# Altium schematic sheet PICkit_2.SchDoc
size A3; SheetNumber: 1; SheetTotal: 1
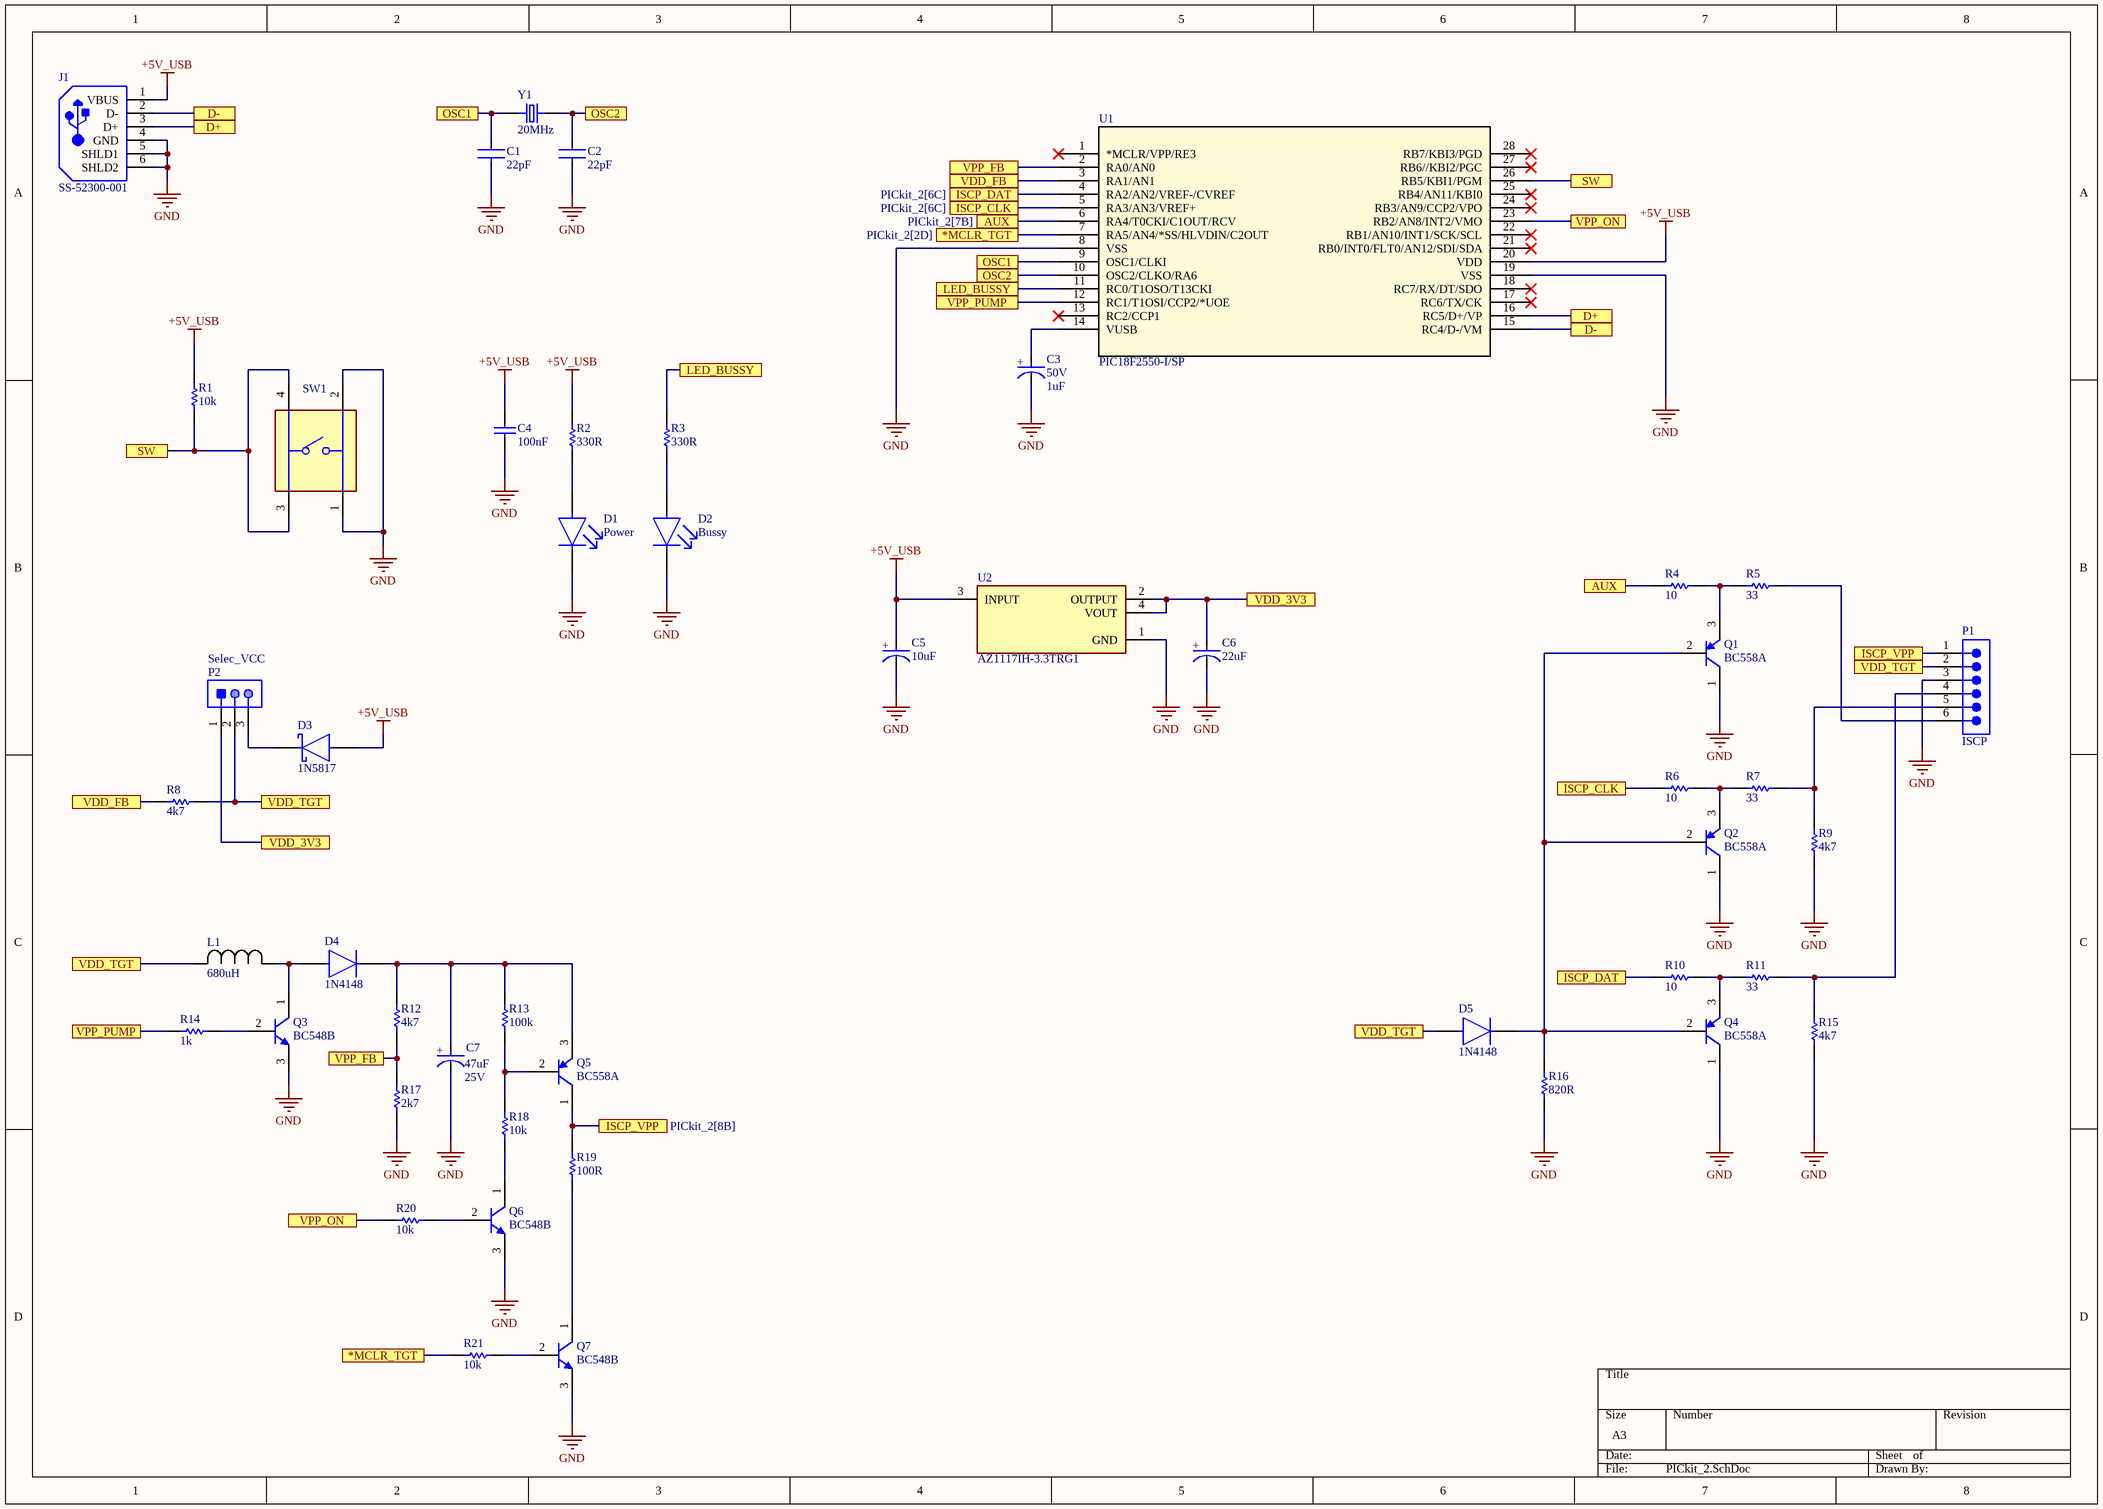
[diagram p0: PICkit_2.SchDoc]

## Parts
C1  Capacitance: 22pF  [FP-RCE0K1-MFG]  (hidden comment: RCE5C1H220J0K1H03B)
C2  Capacitance: 22pF  [FP-RCE0K1-MFG]  (hidden comment: RCE5C1H220J0K1H03B)
C3  Voltage: 50V  Capacitance: 1uF  [FP-RAD-TH-D_5_0_5-L_11_1-MFG]  (hidden comment: EEUHD1H1R0)
C4  Capacitance: 100nF  [CAPR51-254-508X318X736]  (hidden comment: C320C104K5R5TA)
C5  Capacitance: 10uF  [FP-RAD-TH-D_5_0_5-L_11_1-MFG]  (hidden comment: ECA1HHG100I)
C6  Capacitance: 22uF  [FP-RAD-TH-D_5_0_5-L_11_1-MFG]  (hidden comment: ECA1CM220B)
C7  Voltage Rating: 25V  Capacitance: 47uF  [FP-RAD-TH-D_5_0_5-L_11_1-MFG]  (hidden comment: EEUFM1E470)
D1  Colour: Power  [FP-HLMP-1719-MFG]  (hidden comment: HLMP-1719)
D2  Colour: Bussy  [FP-HLMP-1719-MFG]  (hidden comment: HLMP-1719)
D3  1N5817  [FP-DO-41-MFG]
D4  1N4148  [FP-6_560-5004_12-4-MFG]
D5  1N4148  [FP-6_560-5004_12-4-MFG]
J1  SS-52300-001  [SS-52300-001]
L1  Inductance: 680uH  [IND_BOURNS_78F]  (hidden comment: 78F681J-RC)
P1  ISCP  [SMTC-TSW-106-08-X-S-RA]
P2  Action: Selec_VCC  [MOLX-22-28-4033_V]  (hidden comment: 22-28-4033)
Q1  BC558A  [ONSC-TO-92-3-29-11_AM_BL]
Q2  BC558A  [ONSC-TO-92-3-29-11_AM_BL]
Q3  BC548B  [ONSC-TO-92-3-29-11]
Q4  BC558A  [ONSC-TO-92-3-29-11_AM_BL]
Q5  BC558A  [ONSC-TO-92-3-29-11_AM_BL]
Q6  BC548B  [ONSC-TO-92-3-29-11]
Q7  BC548B  [ONSC-TO-92-3-29-11]
R1  Resistance: 10k  [CF14JT10K0]  (hidden comment: CF14JT10K0)
R2  Resistance: 330R  [CF14JT10K0]  (hidden comment: 1-1623728-6)
R3  Resistance: 330R  [CF14JT10K0]  (hidden comment: 1-1623728-6)
R4  Resistance: 10  [RESA60-630X240]  (hidden comment: MFR-25FBF52-1K)
R5  Resistance: 33  [RESA60-630X240]  (hidden comment: MFR-25FBF52-1K)
R6  Resistance: 10  [RESA60-630X240]  (hidden comment: MFR-25FBF52-1K)
R7  Resistance: 33  [RESA60-630X240]  (hidden comment: MFR-25FBF52-1K)
R8  Resistance: 4k7  [CF14JT10K0]
R9  Resistance: 4k7  [CF14JT10K0]
R10  Resistance: 10  [RESA60-630X240]  (hidden comment: MFR-25FBF52-1K)
R11  Resistance: 33  [RESA60-630X240]  (hidden comment: MFR-25FBF52-1K)
R12  Resistance: 4k7  [CF14JT10K0]
R13  Resistance: 100k  [RESA60-630X240]  (hidden comment: MFR-25FBF52-1K)
R14  Resistance: 1k  [RESA60-630X240]  (hidden comment: MFR-25FBF52-1K)
R15  Resistance: 4k7  [CF14JT10K0]
R16  Resistance: 820R  [RESA60-630X240]  (hidden comment: MFR-25FBF52-1K)
R17  Resistance: 2k7  [RESA60-630X240]  (hidden comment: MFR-25FBF52-1K)
R18  Resistance: 10k  [RESA60-630X240]  (hidden comment: MFR-25FBF52-1K)
R19  Resistance: 100R  [RESA60-630X240]  (hidden comment: MFR-25FBF52-1K)
R20  Resistance: 10k  [RESA60-630X240]  (hidden comment: MFR-25FBF52-1K)
R21  Resistance: 10k  [RESA60-630X240]  (hidden comment: MFR-25FBF52-1K)
SW1  TS02-66-60-BK-100-LCR-D  [SW_TS02-66-60-BK-100-LCR-D]  (value not drawn)
U1  PIC18F2550-I/SP  [PIC18F2550-I/SP]
U2  AZ1117IH-3.3TRG1  [FP-SOT223-IPC_B]
Y1  Frequency: 20MHz  [XTAL_ECS-200-20-4X]  (hidden comment: ECS-200-20-4X)

## Ports
*MCLR_TGT (see PICkit_2[2D]), *MCLR_TGT (see PICkit_2[4A]), AUX (see PICkit_2[4A]), AUX (see PICkit_2[7B]), D+ (see PICkit_2[1A]), D+ (see PICkit_2[6A]), D- (see PICkit_2[1A]), D- (see PICkit_2[6A]), ISCP_CLK (see PICkit_2[4A]), ISCP_CLK (see PICkit_2[6C]), ISCP_DAT (see PICkit_2[4A]), ISCP_DAT (see PICkit_2[6C]), ISCP_VPP (see PICkit_2[3C]), ISCP_VPP (see PICkit_2[8B]), LED_BUSSY (see PICkit_2[3A]), LED_BUSSY (see PICkit_2[4A]), OSC1 (see PICkit_2[2A]), OSC1 (see PICkit_2[4A]), OSC2 (see PICkit_2[3A]), OSC2 (see PICkit_2[4A]), SW (see PICkit_2[1B]), SW (see PICkit_2[6A]), VDD_3V3 (see PICkit_2[1C]), VDD_3V3 (see PICkit_2[5B]), VDD_FB (see PICkit_2[1C]), VDD_FB (see PICkit_2[4A]), VDD_TGT (see PICkit_2[1C], PICkit_2[6C]), VDD_TGT (see PICkit_2[1C], PICkit_2[6C], PICkit_2[8B]), VDD_TGT (see PICkit_2[1C], PICkit_2[8B]), VPP_FB (see PICkit_2[2C]), VPP_FB (see PICkit_2[4A]), VPP_ON (see PICkit_2[2D]), VPP_ON (see PICkit_2[6A]), VPP_PUMP (see PICkit_2[1C]), VPP_PUMP (see PICkit_2[4A])

## Nets
+5V_USB: C4.1 C5.2(A) D3.2(A) J1.1(VBUS) R1.2 R2.1 U1.20(VDD) U2.3(INPUT)
GND: C1.1 C2.1 C3.1(C) C4.2 C5.1(C) C6.1(C) C7.1(C) D1.1(C) D2.1(C) J1.4(GND) J1.5(SHLD1) J1.6(SHLD2) P1.3 Q1.1(C) Q2.1(C) Q3.3(E) Q4.1(C) Q6.3(E) Q7.3(E) R9.2 R15.2 R16.1 R17.1 SW1.1 SW1.2 U1.8(VSS) U1.19(VSS) U2.1(GND)
*MCLR_TGT: R21.2 U1.7(RA5/AN4/*SS/HLVDIN/C2OUT) ; port *MCLR_TGT
AUX: R4.2 U1.6(RA4/T0CKI/C1OUT/RCV) ; port AUX
D+: J1.3(D+) U1.16(RC5/D+/VP) ; port D+
D-: J1.2(D-) U1.15(RC4/D-/VM) ; port D-
ISCP_CLK: R6.2 U1.5(RA3/AN3/VREF+) ; port ISCP_CLK
ISCP_DAT: R10.2 U1.4(RA2/AN2/VREF-/CVREF) ; port ISCP_DAT
ISCP_VPP: P1.1 Q5.1(C) R19.2 ; port ISCP_VPP
LED_BUSSY: R3.1 U1.11(RC0/T1OSO/T13CKI) ; port LED_BUSSY
OSC1: C1.2 U1.9(OSC1/CLKI) Y1.1 ; port OSC1
OSC2: C2.2 U1.10(OSC2/CLKO/RA6) Y1.2 ; port OSC2
SW: R1.1 SW1.3 SW1.4 U1.26(RB5/KBI1/PGM) ; port SW
VDD_3V3: C6.2(A) P2.1 U2.2(OUTPUT) U2.4(VOUT) ; port VDD_3V3
VDD_FB: R8.2 U1.3(RA1/AN1) ; port VDD_FB
VDD_TGT: D5.2(A) L1.2 P1.2 P2.2 R8.1 ; port VDD_TGT
VPP_FB: R12.2 R17.2 U1.2(RA0/AN0) ; port VPP_FB
VPP_ON: R20.2 U1.23(RB2/AN8/INT2/VMO) ; port VPP_ON
VPP_PUMP: R14.1 U1.12(RC1/T1OSI/CCP2/*UOE) ; port VPP_PUMP
NetC3_2: C3.2(A) U1.14(VUSB)
NetC7_2: C7.2(A) D4.1(C) Q5.3(E) R12.1 R13.2
NetD1_2: D1.2(A) R2.2
NetD2_2: D2.2(A) R3.2
NetD3_1: D3.1(C) P2.3
NetD4_2: D4.2(A) L1.1 Q3.1(C)
NetD5_1: D5.1(C) Q1.2(B) Q2.2(B) Q4.2(B) R16.2
NetP1_4: P1.4 R11.1 R15.1
NetP1_5: P1.5 R7.1 R9.1
NetP1_6: P1.6 R5.1
NetQ1_3: Q1.3(E) R4.1 R5.2
NetQ2_3: Q2.3(E) R6.1 R7.2
NetQ3_2: Q3.2(B) R14.2
NetQ4_3: Q4.3(E) R10.1 R11.2
NetQ5_2: Q5.2(B) R13.1 R18.2
NetQ6_1: Q6.1(C) R18.1
NetQ6_2: Q6.2(B) R20.1
NetQ7_1: Q7.1(C) R19.1
NetQ7_2: Q7.2(B) R21.1

Not connected (* = marked no-connect by the designer): U1 1(*MCLR/VPP/RE3)* 13(RC2/CCP1)* 17(RC6/TX/CK)* 18(RC7/RX/DT/SDO)* 21(RB0/INT0/FLT0/AN12/SDI/SDA)* 22(RB1/AN10/INT1/SCK/SCL)* 24(RB3/AN9/CCP2/VPO)* 25(RB4/AN11/KBI0)* 27(RB6//KBI2/PGC)* 28(RB7/KBI3/PGD)*

## Notes on the sheet
- (in symbol CMP-05427-000115-1) +
- (in symbol CMP-05427-000260-1) +
- (in symbol CMP-05427-000601-1) +
- (in symbol CMP-05427-001020-1) +

## Library data of the parts
C1 C2 = CMP-06035-047580-1: Cap Ceramic 22pF 50V C0G ±5% Radial 5mm +125°C Automotive Bulk; Manufacturer: Murata; Lead/Base Style: Formed Leads; Lead Diameter: 0.5mm; Tolerance: 5%; Dielectric: C0G; Case/Package: Radial; Min Operating Temperature: -55°C; Height: 3.5mm; Length: 0.142inch; Height - Seated (Max): 0.138inch; Lead Pitch: 0.197inch; Resistor Type: Ceramic; Max Operating Temperature: 125°C; Package Quantity: 500; Mount: Through Hole; Ratings: AEC-Q200; Termination: Radial; Voltage Rating: 50V; Width: 0.098inch; Voltage Rating (DC): 50V; Packaging: Bulk; Supplier 1: Digi-Key; Supplier Part Number 1: 490-12836-ND; Manufacturer Part Number: RCE5C1H220J0K1H03B; RoHS: Yes; Category: Ceramic Capacitors; Stock 1: 685; Pricing 1: 1=0.47000, 10=0.33100, 50=0.25020, 100=0.21790, 500=0.16140, 1000=0.13719, 2500=0.12912, 5000=0.12105 (USD); RoHS Compliant: Yes; ComponentLink1URL: https://datasheet.ciiva.com/18700/product-18700305.pdf?src-supplier=Digi-Key; ComponentLink1Description: https://datasheet.ciiva.com/18700/product-18700305.pdf?src-supplier=Digi-Key
C3 = CMP-05427-001020-1: Aluminum Electrolytic Capacitors (Radial Lead Type) AEC-Q200 Qualified 1uF ±20% 50V; Polarity: Polar; Lead/Base Style: Straight; Ripple Current (AC): 10mA; Lead Diameter: 0.5mm; Life (Hours): 1000Hour; Construction: RADIAL; REACH SVHC: No SVHC; RoHS Compliant: Yes; Max Operating Temperature: 105°C; Height - Seated (Max): 0.492inch; Mount: Through Hole; Case/Package: Radial; Voltage Rating (DC): 50V; Height: 11mm; Lead Pitch: 2.5mm; Packaging: Bulk; Voltage Rating: 50V; Package Quantity: 200; Number of Pins: 2; Tolerance: 20%; Series: HD; Length: 12.5mm; Ripple Current: 10mA; Diameter: 5mm; Min Operating Temperature: -55°C; Termination: Radial
C4 = CMP-1664-00004-1: Radial Leaded Multilayer Ceramic Capacitor, 0.1 uF, +/- 10%, 50 V, -55 to 125 degC, 2-Pin THD, RoHS, Tape and Reel; Manufacturer: KEMET; Case\Package: SOT-23-5; Max Power Dissipation: 250 mW; Output Current: 150 mA; Dropout Voltage: 260 mV; Outputs: 1; Output Voltage: 5 V; Max Input Voltage: 8 V; Voltage Rating (DC): 50V; Dielectric: X7R; Dissipation Factor: 2.5%; Lead/Base Style: Straight; Lead Diameter: 0.51mm; Lead Length: 7mm; Min Operating Temperature: -40 degC; Packaging: Tape and Reel; Height: 1.3 mm; Radiation Hardening: No; Pins: 5; ComponentLink1Description: Manufacturer URL; Mount: Surface Mount; RoHSCompliant: true; Max Operating Temperature: 85 degC; PackageReference: CAPR51-254-508X318X736; ComponentLink2URL: http://www.kemet.com/docfinder?Partnumber=C320C104K5R5TA; PackageDescription: 2-Pin Through Hole Device, Body 5.08 x 3.18 mm, Pitch 2.54 mm; ComponentLink1URL: http://www.kemet.com/; Width: 1.8 mm; Package Quantity: 3000; DatasheetVersion: Dec-15; Length: 3 mm; ComponentLink2Description: Datasheet; Supplier 1: Digi-Key; Supplier Part Number 1: 399-4264-ND; Manufacturer Part Number: C320C104K5R5TA; RoHS: Yes; Category: Ceramic Capacitors; Stock 1: 268489; Pricing 1: 1=0.22000, 10=0.15200, 50=0.10100, 100=0.08580, 500=0.06060, 1000=0.05302, 2500=0.05050, 5000=0.04671 (USD); Case/Package: Radial; Number of Pins: 2; Dielectric Material: Ceramic; Tolerance: 10%; Termination: Radial; Series: GoldMax 300 Comm X7R; Construction: RADIAL; Voltage Rating: 50V; Voltage: 50V; Resistor Type: Ceramic; Lead Pitch: 2.54mm; Height - Seated (Max): 0.26inch; Depth: 3.18mm; RoHS Compliant: Yes; Reach SVHC Compliant: Yes; Lead Free: Lead Free; ComponentLink3URL: https://datasheet.ciiva.com/7817/1732702-7817354.pdf?src-supplier=Element14; ComponentLink3Description: https://datasheet.ciiva.com/7817/1732702-7817354.pdf?src-supplier=Element14; ComponentLink4URL: https://datasheet.ciiva.com/27052/1570161-27052544.pdf?src-supplier=Jameco; ComponentLink4Description: https://datasheet.ciiva.com/27052/1570161-27052544.pdf?src-supplier=Jameco; ComponentLink5URL: https://datasheet.ciiva.com/11786/0900766b80717e24-11786584.pdf?src-supplier=RSComponents; ComponentLink5Description: https://datasheet.ciiva.com/11786/0900766b80717e24-11786584.pdf?src-supplier=RSComponents; ComponentLink6URL: https://datasheet.ciiva.com/39122/f3101-goldmax-39122993.pdf?src-supplier=Onlinecomponents.com; ComponentLink6Description: https://datasheet.ciiva.com/39122/f3101-goldmax-39122993.pdf?src-supplier=Onlinecomponents.com; ComponentLink7URL: https://datasheet.ciiva.com/7817/f3101-goldmax-7817514.pdf?src-supplier=Element14; ComponentLink7Description: https://datasheet.ciiva.com/7817/f3101-goldmax-7817514.pdf?src-supplier=Element14; ComponentLink8URL: https://datasheet.ciiva.com/14585/70095037-14585005.pdf?src-supplier=Allied+Electronics; ComponentLink8Description: https://datasheet.ciiva.com/14585/70095037-14585005.pdf?src-supplier=Allied+Electronics; ComponentLink9URL: https://datasheet.ciiva.com/5389/f3101-goldmax-334604-5389886.pdf?src-supplier=Mouser; ComponentLink9Description: https://datasheet.ciiva.com/5389/f3101-goldmax-334604-5389886.pdf?src-supplier=Mouser
C5 = CMP-05427-000260-1: Aluminum Electrolytic Capacitors (Radial Lead Type) AEC-Q200 Qualified 10uF ±20% 50V; Manufacturer: Panasonic; Lead Diameter: 0.5mm; Polarity: Polar; Leakage Current: 3uA; Life (Hours): 1000Hour; Ripple Current: 39mA; Lead/Base Style: Straight; Max Operating Temperature: 105°C; Voltage Rating (DC): 50V; Diameter: 5mm; RoHS Compliant: Yes; Packaging: Ammo Pack; Series: NHG; Construction: RADIAL; Length: 11mm; Tolerance: 20%; Height - Seated (Max): 0.472inch; Contact Plating: Tin; Height: 11mm; Min Operating Temperature: -55°C; Radiation Hardening: No; Package Quantity: 2000; Mount: Through Hole; Voltage Rating: 50V; Lead Pitch: 2.5mm; Termination: Radial; Lead Free: Lead Free; Case/Package: Radial; Supplier 1: Digi-Key; Supplier Part Number 1: P19445CT-ND; Manufacturer Part Number: ECA1HHG100I; RoHS: Yes; Category: Aluminum Electrolytic Capacitors; Stock 1: 46120; Pricing 1: 1=0.33000, 10=0.22800, 50=0.15200, 100=0.12920, 500=0.09120, 1000=0.07980 (USD); ComponentLink1URL: https://datasheet.ciiva.com/26882/getdatasheetpartid-479260-26882746.pdf?src-supplier=Verical; ComponentLink1Description: https://datasheet.ciiva.com/26882/getdatasheetpartid-479260-26882746.pdf?src-supplier=Verical; ComponentLink2URL: https://datasheet.ciiva.com/11680/aba0000ce26-11680984.pdf?src-supplier=Avnet; ComponentLink2Description: https://datasheet.ciiva.com/11680/aba0000ce26-11680984.pdf?src-supplier=Avnet
C6 = CMP-05427-000115-1: Aluminum Electrolytic Capacitors (Radial Lead Type) 22uF ±20% 16V; Manufacturer: Panasonic; Manufacturer Part Number: ECA-1CM220B; Lead Diameter: 0.5mm; Polarity: Polar; Life (Hours): 2000Hour; Ripple Current: 75mA; Lead/Base Style: Straight; Radiation Hardening: No; Height: 11mm; Tolerance: 20%; Min Operating Temperature: -40°C; Termination: Radial; Packaging: Ammo Pack; Height - Seated (Max): 0.472inch; Voltage Rating (DC): 16V; Length: 11mm; Case/Package: Radial; Diameter: 5mm; Package Quantity: 2000; RoHS Compliant: Yes; Max Operating Temperature: 85°C; Lead Pitch: 5mm; Series: M; Mount: Through Hole; Voltage Rating: 16V; Supplier 1: Digi-Key; Supplier Part Number 1: 10-ECA-1CM220BCT-ND; RoHS: Yes; Category: Aluminum Electrolytic Capacitors; Stock 1: 5985; Pricing 1: 1=0.28000, 10=0.19300, 50=0.11580, 100=0.09780, 500=0.06696, 1000=0.05922 (USD); ComponentLink1URL: http://www.mouser.com/ds/2/315/ABA0000C1218-1131230.pdf?src-supplier=Mouser; ComponentLink1Description: http://www.mouser.com/ds/2/315/ABA0000C1218-1131230.pdf?src-supplier=Mouser; ComponentLink2URL: http://www.onlinecomponents.com/datasheet/eca-1cm220b.aspx?p=44446502&src-supplier=Onlinecomponents.com; ComponentLink2Description: http://www.onlinecomponents.com/datasheet/eca-1cm220b.aspx?p=44446502&src-supplier=Onlinecomponents.com; ComponentLink3URL: https://media.digikey.com/pdf/Data%20Sheets/Panasonic%20Capacitors%20PDFs/ECA-xxM%20Spec.pdf?src-supplier=Digi-Key; ComponentLink3Description: https://media.digikey.com/pdf/Data%20Sheets/Panasonic%20Capacitors%20PDFs/ECA-xxM%20Spec.pdf?src-supplier=Digi-Key; ComponentLink4URL: http://industrial.panasonic.com/www-data/pdf/ABA0000/ABA0000CE12.pdf?src-supplier=Avnet; ComponentLink4Description: http://industrial.panasonic.com/www-data/pdf/ABA0000/ABA0000CE12.pdf?src-supplier=Avnet
C7 = CMP-05427-000601-1: Aluminum Electrolytic Capacitors (Radial Lead Type) 47uF ±20% 25V; Manufacturer: Panasonic; Life (Hours): 2000Hour; Ripple Current: 280mA; Lead Diameter: 0.5mm; ESR (Equivalent Series Resistance): 300mR; Dissipation Factor: 0.14%; Case/Package: Radial; Contact Plating: Tin; Lead Free: Lead Free; Lead Pitch: 2mm; Mount: Through Hole; Features: General Purpose; Length: 11mm; Height: 11mm; Number of Pins: 2; Max Operating Temperature: 105°C; Construction: RADIAL; Series: FM; Voltage Rating (DC): 25V; Termination: Radial; Package Quantity: 200; Min Operating Temperature: -40°C; Ripple Current (AC): 280mA; Radiation Hardening: No; Tolerance: 20%; Height - Seated (Max): 0.433inch; Diameter: 5mm; REACH SVHC: No SVHC; Packaging: Bulk; RoHS Compliant: Yes; Voltage: 25V; Impedance: 300mR; Supplier 1: Digi-Key; Supplier Part Number 1: P12923-ND; Manufacturer Part Number: EEUFM1E470; RoHS: Yes; Category: Aluminum Electrolytic Capacitors; Stock 1: 2; Pricing 1: 1=0.43000, 10=0.29200, 50=0.19440, 100=0.16530, 500=0.11670, 1000=0.10211, 2500=0.09725, 5000=0.08996 (USD); Reach SVHC Compliant: Yes; ComponentLink1URL: https://datasheet.ciiva.com/11777/0900766b805f3abe-11777793.pdf?src-supplier=RSComponents; ComponentLink1Description: https://datasheet.ciiva.com/11777/0900766b805f3abe-11777793.pdf?src-supplier=RSComponents; ComponentLink2URL: https://datasheet.ciiva.com/46396/654842-46396775.pdf?src-supplier=Element14; ComponentLink2Description: https://datasheet.ciiva.com/46396/654842-46396775.pdf?src-supplier=Element14; ComponentLink3URL: https://datasheet.ciiva.com/11680/aba0000ce108-11680078.pdf?src-supplier=Avnet; ComponentLink3Description: https://datasheet.ciiva.com/11680/aba0000ce108-11680078.pdf?src-supplier=Avnet; ComponentLink4URL: https://datasheet.ciiva.com/92/aba0000ce108-92343.pdf?src-supplier=Digi-Key; ComponentLink4Description: https://datasheet.ciiva.com/92/aba0000ce108-92343.pdf?src-supplier=Digi-Key; ComponentLink5URL: https://datasheet.ciiva.com/48542/eeufm-series-eng-tds-48542709.pdf?src-supplier=Distrelec; ComponentLink5Description: https://datasheet.ciiva.com/48542/eeufm-series-eng-tds-48542709.pdf?src-supplier=Distrelec; ComponentLink6URL: https://datasheet.ciiva.com/43458/654842-43458220.pdf?src-supplier=Farnell; ComponentLink6Description: https://datasheet.ciiva.com/43458/654842-43458220.pdf?src-supplier=Farnell
D1 D2 = CMP-2000-06410-2: LED YELLOW DIFFUSED T-1 T/H; Manufacturer: Broadcom; Wavelength: 585nm; Led Orientation: Straight; Luminous Intensity: 2.1mcd; Forward Voltage: 1.8V; Viewing Angle: 50°; Reverse Voltage: 5V; Power Dissipation: 17.5mW; Forward Current: 2mA; Number of Elements: 1; Lens Style: Dome,Round,Circular,Diffused,Colored; Lens Size: 3mm; Lead Length: 24mm; Lead Free: Yes; Automotive: No; Device Class L1: Optoelectronics; Mouser Description: Standard LEDs - Through Hole Yellow Diffused 585nm 2.1mcd; Digikey Description: LED YELLOW DIFFUSED T-1 T/H; Temperature: -40°C to +100°C; Temperature Range High: +100°C; Package: 0; Category: Diode; Device Class L2: LEDs; ComponentLink2Description: Datasheet; ComponentLink2URL: https://docs.broadcom.com/docs/AV02-1557EN; Temperature Range Low: -40°C; Device Class L3: unset; Octopart: https://octopart.com/hlmp-1719-broadcom-71130405; RoHS: TRUE; Manufacturer Part Number: HLMP-1719; Supplier 1: Digi-Key; Supplier Part Number 1: 516-1309-ND; Stock 1: 77780; Pricing 1: 1=0.51000, 10=0.31300, 100=0.18000, 1000=0.14090, 2000=0.12916, 5000=0.11742, 10000=0.10959, 25000=0.10568 (USD); Mount: Through Hole; Case/Package: T; Number of Pins: 2; Color: Yellow; Contact Plating: Tin,Matte; Lens Color: Yellow; Min Operating Temperature: -40°C; Max Operating Temperature: 100°C; Package Quantity: 2000; Packaging: Bulk; Series: -; Illumination Color: Yellow; Dominant Wavelength: 585nm; Test Current: 2mA; Lens Transparency: Diffused; Number of LEDs: 1; Max Power Dissipation: 17.5mW; Diameter: 3mm; Length: 3.43mm; Height: 6.35mm; Depth: 3.43mm; Radiation Hardening: No; Reach SVHC Compliant: Yes; RoHS Compliant: Yes; ComponentLink1URL: https://datasheet.ciiva.com/1244/1715378-1244676.pdf?src-supplier=Element14; ComponentLink1Description: https://datasheet.ciiva.com/1244/1715378-1244676.pdf?src-supplier=Element14; ComponentLink3URL: https://datasheet.ciiva.com/15117/getdatasheetpartid-111138-15117505.pdf?src-supplier=Verical; ComponentLink3Description: https://datasheet.ciiva.com/15117/getdatasheetpartid-111138-15117505.pdf?src-supplier=Verical; ComponentLink4URL: https://datasheet.ciiva.com/11773/0900766b800204ad-11773897.pdf?src-supplier=RSComponents; ComponentLink4Description: https://datasheet.ciiva.com/11773/0900766b800204ad-11773897.pdf?src-supplier=RSComponents; ComponentLink5URL: https://datasheet.ciiva.com/19482/253673-19482303.pdf?src-supplier=Jameco; ComponentLink5Description: https://datasheet.ciiva.com/19482/253673-19482303.pdf?src-supplier=Jameco; ComponentLink6URL: https://datasheet.ciiva.com/29334/180618-da-01-en-led-3mm-hlmp-1719-gelb-29334897.pdf?src-supplier=Conrad; ComponentLink6Description: https://datasheet.ciiva.com/29334/180618-da-01-en-led-3mm-hlmp-1719-gelb-29334897.pdf?src-supplier=Conrad; ComponentLink7URL: https://datasheet.ciiva.com/14605/70157746-14605453.pdf?src-supplier=Allied+Electronics; ComponentLink7Description: https://datasheet.ciiva.com/14605/70157746-14605453.pdf?src-supplier=Allied+Electronics; ComponentLink8URL: https://datasheet.ciiva.com/14183/efhlmp17x-47xx-en-14183894.pdf?src-supplier=Distrelec; ComponentLink8Description: https://datasheet.ciiva.com/14183/efhlmp17x-47xx-en-14183894.pdf?src-supplier=Distrelec
D3 = CMP-12187-000037-1: DIODE SCHOTTKY 20V 1A DO41; Manufacturer: STMicroelectronics; Max Forward Surge Current (Ifsm): 25A; Forward Voltage: 450mV; Max Reverse Leakage Current: 500uA; Element Configuration: Single; Polarity: Standard; Capacitance: 110pF; Length: 5.2mm; Min Operating Temperature: -65°C; Series: -; Packaging: Cut Tape; Output Current: 1A; RoHS Compliant: Yes; Max Surge Current: 25A; Voltage Rating (DC): 20V; Number of Pins: 2; Width: 2.7mm; Max Reverse Voltage (DC): 20V; Height: 2.7mm; Weight: 0.01lb; Max Operating Temperature: 150°C; Current Rating: 1A; Lead Free: Lead Free; Case/Package: DO-41; Radiation Hardening: No; Package Quantity: 2000; Forward Current: 1A; Max Repetitive Reverse Voltage (Vrrm): 20V; Peak Non-Repetitive Surge Current: 25A; REACH SVHC: No SVHC; Average Rectified Current: 1A; Max Reverse Current: 500uA; Mount: Through Hole; Supplier 1: Digi-Key; Supplier Part Number 1: 497-4547-1-ND; Manufacturer Part Number: 1N5817; RoHS: Yes; Category: Rectifier Diodes; Stock 1: 14557; Pricing 1: 1=0.45000, 10=0.36200, 100=0.24650, 500=0.18490, 1000=0.13867 (USD); Reach SVHC Compliant: Yes; ComponentLink1URL: https://datasheet.ciiva.com/16303/cd00001625-16303281.pdf?src-supplier=Future+Electronics; ComponentLink1Description: https://datasheet.ciiva.com/16303/cd00001625-16303281.pdf?src-supplier=Future+Electronics; ComponentLink2URL: https://datasheet.ciiva.com/17094/1n5817-17094606.pdf?src-supplier=Allied+Electronics; ComponentLink2Description: https://datasheet.ciiva.com/17094/1n5817-17094606.pdf?src-supplier=Allied+Electronics; ComponentLink3URL: https://datasheet.ciiva.com/915/cd00001625-915554.pdf?src-supplier=Digi-Key; ComponentLink3Description: https://datasheet.ciiva.com/915/cd00001625-915554.pdf?src-supplier=Digi-Key; ComponentLink4URL: https://datasheet.ciiva.com/915/cd00001625-915553.pdf?src-supplier=Digi-Key; ComponentLink4Description: https://datasheet.ciiva.com/915/cd00001625-915553.pdf?src-supplier=Digi-Key; ComponentLink5URL: https://datasheet.ciiva.com/4715/cd00001625-4715125.pdf?src-supplier=Mouser; ComponentLink5Description: https://datasheet.ciiva.com/4715/cd00001625-4715125.pdf?src-supplier=Mouser
D4 D5 = CMP-02540-000029-2: DIODE GEN PURP 75V 300MA DO35; Manufacturer: Vishay Vitramon; Manufacturer Part Number: 1N4148TR; Element Configuration: Single; Power Dissipation: 440mW; Reverse Recovery Time: 8ns; Peak Non-Repetitive Surge Current: 2A; Max Repetitive Reverse Voltage (Vrrm): 100V; Forward Voltage: 1V; Current Rating: 150A; Number of Pins: 2; Packaging: Tape and Reel; Mount: Through Hole; Forward Current: 300mA; Lead Free: Lead Free; Max Operating Temperature: 175°C; Min Operating Temperature: -65°C; Supplier 1: Digi-Key; Supplier Part Number 1: 1N4148VSCT-ND; RoHS: Yes; Category: Rectifier Diodes; Stock 1: 377746; Pricing 1: 1=0.10000, 10=0.09200, 100=0.05000, 500=0.03078, 1000=0.02099, 2000=0.01784, 5000=0.01609 (USD); ComponentLink1URL: http://www.farnell.com/datasheets/2047060.pdf?src-supplier=Farnell; ComponentLink1Description: http://www.farnell.com/datasheets/2047060.pdf?src-supplier=Farnell; ComponentLink2URL: http://www.onlinecomponents.com/datasheet/1n4148tr.aspx?p=12726765&src-supplier=Onlinecomponents.com; ComponentLink2Description: http://www.onlinecomponents.com/datasheet/1n4148tr.aspx?p=12726765&src-supplier=Onlinecomponents.com; ComponentLink3URL: http://www.farnell.com/datasheets/2047060.pdf?src-supplier=Element14; ComponentLink3Description: http://www.farnell.com/datasheets/2047060.pdf?src-supplier=Element14; ComponentLink4URL: http://www.farnell.com/datasheets/2047060.pdf?src-supplier=Newark; ComponentLink4Description: http://www.farnell.com/datasheets/2047060.pdf?src-supplier=Newark
J1 = SS-52300-001: Usb 2.0 Right Angle Receptacle Type B; Usb 2.0 Right Angle Receptacle Type B; Manufacturer: Bel; Supplier 1: Digi-Key; Supplier Part Number 1: 380-1492-ND; Manufacturer Part Number: SS-52300-001; RoHS: No; Category: Connectors; Stock 1: 11394; Pricing 1: 1=1.07000, 10=0.90800, 25=0.87120, 40=0.85250, 80=0.81550, 230=0.74135, 440=0.66720, 945=0.59307, 2400=0.53747 (USD); ComponentLink1URL: https://belfuse.com/resources/datasheets/stewartconnector/ds-stw-usb-2.0-type-b-connectors.pdf?src-supplier=Digi-Key; ComponentLink1Description: https://belfuse.com/resources/datasheets/stewartconnector/ds-stw-usb-2.0-type-b-connectors.pdf?src-supplier=Digi-Key
L1 = 78F681J-RC: Ind RF Choke Bobbin Core 680uH 5% 790KHz 60Q-Factor Ferrite 68mA AXL Bag; Mfr_Name: Bourns Electronics; Manufacturer: Bourns; Type: DEV; Self Resonant Frequency: 2MHz; Q Factor: 60; Shielding: Unshielded; DC Resistance (DCR): 25.3R; Lead/Base Style: Axial; Lead Diameter: 0.51mm; Copyright: Copyright (C) 2023 Ultra Librarian. All rights reserved.; Manufacturer_Part_Number: 78F681J-RC; Digi-Key_Part_Number_1: M8156-ND; RefDes: RefDes; Supplier 1: Digi-Key; Supplier Part Number 1: M8156-ND; Manufacturer Part Number: 78F681J-RC; RoHS: Yes; Category: Fixed Inductors; Stock 1: 11377; Pricing 1: 1=0.31000, 10=0.27900, 25=0.24440, 50=0.20940, 100=0.19200, 250=0.17456, 500=0.16408, 1000=0.12568, 2500=0.11870 (USD); Mount: Through Hole; Case/Package: Axial; Core Material: Ferrite; Contact Plating: Tin; Min Operating Temperature: -55°C; Max Operating Temperature: 105°C; Inductance Tolerance: 5%; Package Quantity: 5000; Tolerance: 5%; Current Rating: 68mA; Packaging: Bag; Max DC Current: 68mA; Termination: Axial; Test Frequency: 790kHz; Resistor Type: Wirewound; DC Current: 68mA; Series: 78F; Diameter: 2.79mm; Length: 7.11mm; Reach SVHC Compliant: Yes; Military Standard: Not; Lead Free: Lead Free; RoHS Compliant: Yes; ComponentLink1URL: https://datasheet.ciiva.com/1069/78f-series-1069895.pdf?src-supplier=Digi-Key; ComponentLink1Description: https://datasheet.ciiva.com/1069/78f-series-1069895.pdf?src-supplier=Digi-Key; ComponentLink2URL: https://datasheet.ciiva.com/3076/78f-series-3076618.pdf?src-supplier=Avnet; ComponentLink2Description: https://datasheet.ciiva.com/3076/78f-series-3076618.pdf?src-supplier=Avnet; ComponentLink3URL: https://datasheet.ciiva.com/1474/78f-series-1474733.pdf?src-supplier=Element14; ComponentLink3Description: https://datasheet.ciiva.com/1474/78f-series-1474733.pdf?src-supplier=Element14
P1 = CMP-1024-00390-1: 0.025" SQ Post Header, Through-hole, Right Angle, -55 to 125 degC, 2.54 mm Pitch, 6-Pin, Male, RoHS; Manufacturer: Samtec; PartNumber: TSW-106-08-L-S-RA; Pitch: 2.54 mm; ComponentLink2URL: http://www.samtec.com/documents/webfiles/pdf/TSW_TH.PDF; ComponentLink3Description: Package Specification; PackageVersion: DM, 8/1988; ComponentLink3URL: http://www.samtec.com/documents/webfiles/cpdf/TSW-XXX-XX-XXX-X-XX-XXX-MKT.pdf; ComponentLink1Description: Manufacturer URL; RoHS: True; ComponentLink2Description: Datasheet; PackageDescription: .025[0.64] SQ. Post Terminal Strip Assembly; Temperature Range: -55 to 125 degC; Orientation: Right Angle; DatasheetVersion: F-214; PackageReference: TSW-106-08-X-S-RA; ComponentLink1URL: http://www.samtec.com; Mounting Technology: Through-hole
P2 = CMP-1676-00001-5: Male Header, Pitch 2.54 mm, 1 x 3 Position, Height 8.38 mm, Tail Length 3.18 mm, RoHS, Bulk; Manufacturer: Molex; Rows: 1; Voltage Rating: 250 V; Current Rating: 4 A; Number of Positions: 3; Max Voltage Rating (AC): 250V; Connector Type: Male Pin; Contact Resistance: 20mR; Pitch: 2.54mm; Glow Wire Compliant: Non-compliant; Min Operating Temperature: 0 degC; Lead Pitch: 0.1 inch; Packaging: Bulk; Contact Finish: Gold; RoHSCompliant: true; Contact Material: Brass; PackageReference: 22-28-4033; REACH SVHC: Unknown; PackageDescription: Male Header, Pitch 2.54 mm, 1 x 3 Position, Height 8.38 mm, Tail Length 3.18 mm; ComponentLink2URL: http://www.molex.com/pdm_docs/sd/022284033_sd.pdf; Height: 8.38 mm; Mounting Technology: Through Hole; ComponentLink1Description: Manufacturer URL; Length: 7.62 mm; Mount: Through Hole; DatasheetVersion: Rev. G, 01/2012; Max Operating Temperature: 75 degC; ComponentLink2Description: Datasheet; Colour: Black; Pins: 3; Contact Plating: Gold; Package Quantity: 1; ComponentLink1URL: http://www.molex.com/; Supplier 1: Digi-Key; Supplier Part Number 1: WM50016-03-ND; Manufacturer Part Number: 22-28-4033; RoHS: Yes; Category: Headers and Wire Housings; Stock 1: 8818; Pricing 1: 1=0.27000, 10=0.21800, 100=0.16020 (USD); Color: Black; Housing Color: Black; Housing Material: Nylon; Number of Rows: 1; Termination: Solder; Number of Contacts: 3; Orientation: Straight; Series: KK® 42375; Contact Type: Male Pin; Gender: Male; Max Voltage Rating (DC): 250V; Voltage Rating (DC): 250V; Number of Circuits: 3; Depth: 2.49mm; Contact Mating Length: 0.24inch; Radiation Hardening: No; Flammability Rating: UL94 V-0; RoHS Compliant: Yes; Lead Free: Lead Free; ComponentLink3URL: https://datasheet.ciiva.com/6814/022284363-sd-6814049.pdf?src-supplier=Digi-Key; ComponentLink3Description: https://datasheet.ciiva.com/6814/022284363-sd-6814049.pdf?src-supplier=Digi-Key; ComponentLink4URL: https://datasheet.ciiva.com/30254/32400022284033-pcb-headers-30254252.pdf?src-supplier=Onlinecomponents.com; ComponentLink4Description: https://datasheet.ciiva.com/30254/32400022284033-pcb-headers-30254252.pdf?src-supplier=Onlinecomponents.com; ComponentLink5URL: https://datasheet.ciiva.com/5157/0022284033-pcb-headers-228089-5157414.pdf?src-supplier=Mouser; ComponentLink5Description: https://datasheet.ciiva.com/5157/0022284033-pcb-headers-228089-5157414.pdf?src-supplier=Mouser; ComponentLink6URL: https://datasheet.ciiva.com/27050/879465-27050600.pdf?src-supplier=Jameco; ComponentLink6Description: https://datasheet.ciiva.com/27050/879465-27050600.pdf?src-supplier=Jameco; ComponentLink7URL: https://datasheet.ciiva.com/1433/1630767-1433688.pdf?src-supplier=Element14; ComponentLink7Description: https://datasheet.ciiva.com/1433/1630767-1433688.pdf?src-supplier=Element14; ComponentLink8URL: https://datasheet.ciiva.com/10089/0022284033-pcb-headers-10089958.pdf?src-supplier=Avnet; ComponentLink8Description: https://datasheet.ciiva.com/10089/0022284033-pcb-headers-10089958.pdf?src-supplier=Avnet; ComponentLink9URL: https://datasheet.ciiva.com/15217/getdatasheetpartid-163440-15217708.pdf?src-supplier=Verical; ComponentLink9Description: https://datasheet.ciiva.com/15217/getdatasheetpartid-163440-15217708.pdf?src-supplier=Verical
Q1 Q2 Q4 Q5 = CMP-1048-01515-1: Amplifier Transistor, PNP Silicon, 3-Pin TO-92, Pb-Free, Tape and Reel; PartNumber: BC558BRLG; Manufacturer: On Semiconductor; IC Continuous (A): -0.1; ComponentLink1Description: Manufacturer URL; Mounting Technology: Through Hole; PackageDescription: 3-Pin Transistor Outline, Body 4.825 x 3.685 mm, Pitch 1.27 mm; DatasheetVersion: Rev. 3; ComponentLink1URL: http://www.onsemi.com/; PackageReference: TO-92-3-29-11_AM_BL; Packing: Tape and Reel; Polarity: PNP; ComponentLink3URL: http://www.onsemi.com/pub_link/Collateral/MAC97-D.PDF; ComponentLink2Description: Datasheet; ComponentLink2URL: http://www.onsemi.com/pub_link/Collateral/BC556B-D.PDF; PackageVersion: Rev. AM; ComponentLink3Description: Package Specification; RoHS: TRUE
Q3 Q6 Q7 = CMP-1048-01456-1: Amplifier Transistor, NPN Silicon, 3-Pin TO-92, Bulk Box; Manufacturer: On Semiconductor; IC Continuous (A): 0.1; fT Min (MHz): 150; Mounting Technology: Through Hole; ComponentLink3Description: Package Specification; Polarity: NPN; ComponentLink3URL: http://www.onsemi.cn/pub_link/Collateral/2N6426-D.PDF; PartNumber: BC548B; ComponentLink2Description: Datasheet; ComponentLink1Description: Manufacturer URL; ComponentLink2URL: http://www.onsemi.com/pub_link/Collateral/BC546-D.PDF; PackageReference: TO-92-3-29-11_AM_SL; DatasheetVersion: Rev. 7; PackageDescription: 3-Pin Transistor Outline, Body 4.825 x 3.685 mm, Pitch 1.27 mm; PackageVersion: Rev. AM; Packing: Bulk Box; RoHS: FALSE; ComponentLink1URL: http://www.onsemi.com/
R1 = CF14JT10K0: Res Carbon Film 10K Ohm 5% 0.25W(1/4W) -500ppm/ to|; Manufacturer: Stackpole Electronics; Power Rating: 250mW; Temperature Coefficient: -500ppm/°C; Supplier 1: Digi-Key; Supplier Part Number 1: 10KQTR-ND; Supplier 2: Digi-Key; Manufacturer Part Number: CF14JT10K0; RoHS: Yes; Category: Through-Hole Resistors; Stock 2: 1407504; Pricing 2: 1=0.10000, 10=0.05600, 25=0.04040, 50=0.03080, 100=0.02260, 250=0.01728, 500=0.01382, 1000=0.01017 (USD); Mount: Through Hole,Axial; Case/Package: Conformal; Contact Plating: Tin,Matte; Min Operating Temperature: -55°C; Max Operating Temperature: 155°C; Packaging: Tape and Reel; Tolerance: 5%; Package Quantity: 1; Resistor Type: Carbon Film; Number of Terminations: 2; Max Power Dissipation: 250mW; Features: Flame Retardant Coating; Series: CF; Termination: Axial; Construction: Cylindrical; Diameter: 2.3mm; Length: 6.5mm; Radiation Hardening: No; Lead Free: Lead Free; RoHS Compliant: Yes; Military Standard: Not; ComponentLink1URL: http://components.arrow.com/part/dataview/27619991S9848636N1174?src-supplier=Arrow+Electronics; ComponentLink1Description: http://components.arrow.com/part/dataview/27619991S9848636N1174?src-supplier=Arrow+Electronics; ComponentLink2URL: https://www.seielect.com/catalog/SEI-CF_CFM.pdf?src-supplier=Avnet; ComponentLink2Description: https://www.seielect.com/catalog/SEI-CF_CFM.pdf?src-supplier=Avnet; ComponentLink3URL: https://www.seielect.com/catalog/SEI-Packaging.pdf?src-supplier=Digi-Key; ComponentLink3Description: https://www.seielect.com/catalog/SEI-Packaging.pdf?src-supplier=Digi-Key; ComponentLink4URL: http://www.seielect.com/Catalog/SEI-CF_CFM.pdf?src-supplier=Future+Electronics; ComponentLink4Description: http://www.seielect.com/Catalog/SEI-CF_CFM.pdf?src-supplier=Future+Electronics; ComponentLink5URL: https://www.verical.com/server-webapp/html/getDatasheet?partID=367360&src-supplier=Verical; ComponentLink5Description: https://www.verical.com/server-webapp/html/getDatasheet?partID=367360&src-supplier=Verical; Supplier Part Number 2: CF14JT10K0CT-ND
R2 R3 = CF14JT10K0: Res Wirewound 330 Ohm 5% 11W ±200ppm/C Ceramic AXL Box/Loose; Manufacturer: TE Connectivity; Temperature Coefficient: 200ppm/°C; Supplier 1: Digi-Key; Supplier Part Number 1: A105636-ND; Manufacturer Part Number: 1-1623728-6; RoHS: Yes; Category: Uncategorized; Stock 1: 610; Pricing 1: 1=1.64000, 10=1.45100, 25=1.33400, 50=1.21700, 100=1.05310, 250=0.88928, 500=0.74888, 1000=0.62250, 5000=0.59676 (USD); Mount: Through Hole; Case/Package: Ceramic; Min Operating Temperature: -55°C; Max Operating Temperature: 350°C; Packaging: Bulk; Series: SBC, CGS; Tolerance: 5%; Power Rating: 11W; Package Quantity: 100; Termination: Axial; Max Power Dissipation: 11W; Resistor Type: Wirewound; Number of Terminations: 2; Construction: Rectangular; Length: 50mm; Width: 0.354inch; Height: 0.394inch; Depth: 9mm; RoHS Compliant: Yes; Military Standard: Not; ComponentLink1URL: https://datasheet.ciiva.com/8333/eng-ds-1773278-e-8333999.pdf?src-supplier=Avnet; ComponentLink1Description: https://datasheet.ciiva.com/8333/eng-ds-1773278-e-8333999.pdf?src-supplier=Avnet; ComponentLink2URL: https://datasheet.ciiva.com/6532/eng-ds-1773278-f-6532348.pdf?src-supplier=Digi-Key; ComponentLink2Description: https://datasheet.ciiva.com/6532/eng-ds-1773278-f-6532348.pdf?src-supplier=Digi-Key; ComponentLink3URL: https://datasheet.ciiva.com/30070/eng-ds-1773278-e-30070229.pdf?src-supplier=Onlinecomponents.com; ComponentLink3Description: https://datasheet.ciiva.com/30070/eng-ds-1773278-e-30070229.pdf?src-supplier=Onlinecomponents.com
R4-R7 R10 R11 R13 R14 R16-R21 = CMP-1659-00075-1: Axial Resistor, 1 KOhm, +/- 1%, 250 mW, -55 to 155 degC, 2-Pin THD, RoHS, Bulk; Manufacturer: Yageo; Voltage Rating: 250 V; Power Rating: 250 mW; Temperature Coefficient: 100ppm/°C; Max Power Dissipation: 250mW; Voltage Rating (DC): 200V; Lead Diameter: 0.6mm; ComponentLink2Description: Datasheet; RoHSCompliant: true; PackageReference: MFR-25; Case\Package: Axial; Max Operating Temperature: 155 degC; DatasheetVersion: Apr-13; Tolerance: 1%; ComponentLink1URL: http://www.yageo.com/; Length: 0.248 inch; ComponentLink2URL: http://www.yageo.com/documents/recent/Yageo%20LR_MFR_2013.pdf; Packaging: Bulk; Package Quantity: 200; PackageDescription: 2-Pin Axial Lead, Dia 2.4 mm, Body Length 6.3 mm; Min Operating Temperature: -55 degC; ComponentLink1Description: Manufacturer URL; Supplier 1: Digi-Key; Supplier Part Number 1: 1.00KXBK-ND; Manufacturer Part Number: MFR-25FBF52-1K; RoHS: Yes; Category: Through-Hole Resistors; Stock 1: 104756; Pricing 1: 1=0.10000, 10=0.08100, 25=0.05600, 50=0.04360, 100=0.03110, 250=0.02428, 500=0.01928, 1000=0.01369, 5000=0.01058 (USD); Mount: Through Hole; Case/Package: Axial; Termination: Axial; Resistor Type: Metal Film; Series: MFR; Number of Terminations: 2; Width: 6.3mm; RoHS Compliant: Yes; Lead Free: Lead Free; ComponentLink3URL: https://datasheet.ciiva.com/25646/yageolr-mfr-2013-25646206.pdf?src-supplier=Digi-Key; ComponentLink3Description: https://datasheet.ciiva.com/25646/yageolr-mfr-2013-25646206.pdf?src-supplier=Digi-Key
R8 R9 R12 R15 = CF14JT10K0: Res Thin Film 4.7K Ohm 1% 2/5W ±50ppm/°C Conformal AXL Thru-Hole Ammo Pack; Manufacturer: Vishay Beyschlag; Manufacturer Part Number: MBA02040C4701FC100; Power Rating: 400mW; Voltage Rating: 200V; Lead Diameter: 0.5mm; Supplier 1: Digi-Key; Supplier Part Number 1: BC3517CT-ND; RoHS: Yes; Category: Through-Hole Resistors; Stock 1: 3398; Pricing 1: 1=0.46000, 10=0.33100, 100=0.13260, 500=0.09032 (USD); Mount: Through Hole; Case/Package: Axial; Contact Plating: Tin; Min Operating Temperature: -55°C; Max Operating Temperature: 155°C; Tolerance: 1%; Package Quantity: 5000; Packaging: Tape and Reel; Termination: Axial; Temperature Coefficient: 50ppm/°C; Series: MBA/SMA 0204 - Professional; Resistance Tolerance: 1%; Resistor Type: Thin Film; Number of Terminations: 2; Max Power Dissipation: 400mW; Voltage Rating (DC): 200V; Features: Automotive AEC-Q200; Construction: Cylindrical; Diameter: 1.6mm; Length: 3.6mm; Lead Pitch: 5mm; Radiation Hardening: No; RoHS Compliant: Yes; Military Standard: Not; Reach SVHC Compliant: Yes; Lead Free: Lead Free; ComponentLink1URL: http://www.farnell.com/datasheets/2045688.pdf?src-supplier=Farnell; ComponentLink1Description: http://www.farnell.com/datasheets/2045688.pdf?src-supplier=Farnell; ComponentLink2URL: http://components.arrow.com/part/dataview/43752589S349955N4052?src-supplier=Arrow+Electronics; ComponentLink2Description: http://components.arrow.com/part/dataview/43752589S349955N4052?src-supplier=Arrow+Electronics; ComponentLink3URL: http://www.mouser.com/ds/2/427/mbxsma-239744.pdf?src-supplier=Mouser; ComponentLink3Description: http://www.mouser.com/ds/2/427/mbxsma-239744.pdf?src-supplier=Mouser; ComponentLink4URL: http://www.alliedelec.com/m/d/72a9b4b9281933b6a3b8fa3f9583e3eb.pdf?src-supplier=Allied+Electronics; ComponentLink4Description: http://www.alliedelec.com/m/d/72a9b4b9281933b6a3b8fa3f9583e3eb.pdf?src-supplier=Allied+Electronics; ComponentLink5URL: http://uk.rs-online.com/webdocs/09bb/0900766b809bb010.pdf?src-supplier=RSComponents; ComponentLink5Description: http://uk.rs-online.com/webdocs/09bb/0900766b809bb010.pdf?src-supplier=RSComponents; ComponentLink6URL: http://www.vishay.com/docs/28766/28766.pdf?src-supplier=Avnet; ComponentLink6Description: http://www.vishay.com/docs/28766/28766.pdf?src-supplier=Avnet; ComponentLink7URL: http://www.farnell.com/datasheets/2045688.pdf?src-supplier=Element14; ComponentLink7Description: http://www.farnell.com/datasheets/2045688.pdf?src-supplier=Element14; ComponentLink8URL: http://www.farnell.com/datasheets/2045688.pdf?src-supplier=Newark; ComponentLink8Description: http://www.farnell.com/datasheets/2045688.pdf?src-supplier=Newark
SW1 = TS02-66-60-BK-100-LCR-D: 6 x 6 mm, 4.3 ~ 17 mm Actuator Height, 100 ~ 260 gf, Through Hole, SPST, Tactile Switch; Manufacturer: CUI Devices; Supplier 1: Digi-Key; Supplier Part Number 1: 2223-TS02-66-60-BK-100-LCR-D-ND; Manufacturer Part Number: TS02-66-60-BK-100-LCR-D; RoHS: No; Category: Tactile Switches; Stock 1: 949; Pricing 1: 1=0.10000, 10=0.10000, 25=0.09440, 100=0.08580, 250=0.08068, 500=0.07384, 1000=0.06181, 3000=0.06009, 5000=0.05666 (USD)
U1 = PIC18F2550-I/SP: Microcontroller, 32 Kb Flash, 2048 Ram, 256 EEPROM, 24 I/o, SPDIP-28; Mfr_Name: Microchip; Min Supply Voltage: 4.2V; Max Supply Voltage: 5.5V; Number of PWM Channels: 2; RAM Size: 2KB; Number of Timers/Counters: 4; Number of ADC Channels: 10; Interface: I2C,SPI,USB,UART,USART; Frequency: 48MHz; Number of I/Os: 24; Max Power Dissipation: 1W; Density: 32KB; Data Bus Width: 8b; Number of SPI Channels: 1; Oscillator Type: Internal; Watchdog Timer: Yes; Peripherals: PWM,Brown-out Detect/Reset,POR,WDT,HLVD,I2C; Core Architecture: PIC; Number of Bits: 8; Nominal Supply Current: 1.1mA; Access Time: 48us; Copyright: Copyright (C) 2023 Ultra Librarian. All rights reserved.; Manufacturer_Part_Number: PIC18F2550-I/SP; RefDes: RefDes; Type: DEV; Supplier 1: Digi-Key; Supplier Part Number 1: PIC18F2550-I/SP-ND; Manufacturer: Microchip; Manufacturer Part Number: PIC18F2550-I/SP; RoHS: Yes; Category: Microcontrollers; Stock 1: 2922; Pricing 1: 1=8.04000 (USD); Mount: Through Hole; Case/Package: DIP; Number of Pins: 28; Weight: 0.02lb; Min Operating Temperature: -40°C; Max Operating Temperature: 85°C; Packaging: Rail/Tube; Package Quantity: 15; Number of Programmable I/O: 24; Max Frequency: 48MHz; Number of I2C Channels: 1; Memory Type: FLASH; Memory Size: 32KB; Number of UART Channels: 1; Address Bus Width: 8b; Number of A/D Converters: 1; Supply Current: 1.1mA; Length: 35.56mm; Width: 0.295inch; Height: 0.15inch; Radiation Hardening: No; Reach SVHC Compliant: Yes; Lead Free: Lead Free; RoHS Compliant: Yes; ComponentLink1URL: https://datasheet.ciiva.com/19459/2177651-19459972.pdf?src-supplier=Jameco; ComponentLink1Description: https://datasheet.ciiva.com/19459/2177651-19459972.pdf?src-supplier=Jameco; ComponentLink2URL: https://datasheet.ciiva.com/14131/cepic18f25-data-en-14131789.pdf?src-supplier=Distrelec; ComponentLink2Description: https://datasheet.ciiva.com/14131/cepic18f25-data-en-14131789.pdf?src-supplier=Distrelec; ComponentLink3URL: https://datasheet.ciiva.com/7774/39632e-7774525.pdf?src-supplier=Element14; ComponentLink3Description: https://datasheet.ciiva.com/7774/39632e-7774525.pdf?src-supplier=Element14; ComponentLink4URL: https://datasheet.ciiva.com/7180/720550-7180953.pdf?src-supplier=Newark; ComponentLink4Description: https://datasheet.ciiva.com/7180/720550-7180953.pdf?src-supplier=Newark; ComponentLink5URL: https://datasheet.ciiva.com/9244/39632d-9244668.pdf?src-supplier=Avnet; ComponentLink5Description: https://datasheet.ciiva.com/9244/39632d-9244668.pdf?src-supplier=Avnet; ComponentLink6URL: https://datasheet.ciiva.com/1494/39632e-1494161.pdf?src-supplier=Digi-Key; ComponentLink6Description: https://datasheet.ciiva.com/1494/39632e-1494161.pdf?src-supplier=Digi-Key
U2 = CMP-12756-000043-1: IC REG LINEAR 3.3V 1A SOT223; Manufacturer: Diodes; Output Current: 800mA; Number of Regulators: 1; Dropout Voltage: 1.2V; RoHS Compliant: Yes; Min Current Limit: 1A; Mount: Surface Mount; Packaging: Tape and Reel; Output Voltage: 3.3V; Min Operating Temperature: -40°C; Max Operating Temperature: 125°C; Number of Pins: 3; Case/Package: TO-261-4; Supplier 1: Digi-Key; Supplier Part Number 1: AZ1117IH-3.3TRG1DICT-ND; Manufacturer Part Number: AZ1117IH-3.3TRG1; RoHS: Yes; Category: Voltage Regulators - Linear; Stock 1: 73174; Pricing 1: 1=0.40000, 10=0.32100, 25=0.29360, 100=0.21840, 250=0.19796, 500=0.16384, 1000=0.12288 (USD); ComponentLink1URL: https://www.diodes.com/assets/Datasheets/AZ1117I.pdf?src-supplier=Digi-Key; ComponentLink1Description: https://www.diodes.com/assets/Datasheets/AZ1117I.pdf?src-supplier=Digi-Key
Y1 = ECS-200-20-4X: Crystal 20MHz ±30ppm (Tol) ±50ppm (Stability) 20pF FUND 30Ohm 2-Pin HC-49/USX Thru-Hole Bulk; Manufacturer: ECS International; ESR (Equivalent Series Resistance): 30R; Supplier 1: Digi-Key; Manufacturer Part Number: ECS-200-20-4X; RoHS: Yes; Category: Crystals; Stock 1: 4710; Pricing 1: 1=0.70000, 10=0.58100, 50=0.52260, 100=0.46460, 500=0.44136, 1000=0.37168, 2500=0.34845, 5000=0.33684, 10000=0.32522 (USD); Mount: Through Hole; Min Operating Temperature: -10°C; Max Operating Temperature: 70°C; Package Quantity: 200; Frequency Tolerance: 30ppm; Load Capacitance: 20pF; Packaging: Bulk; Tolerance: 30ppm; Frequency Stability: 50ppm; Termination: Radial; Series: HC-49USX; Length: 0.447inch; Width: 0.183inch; Height: 0.138inch; Lead Free: Lead Free; ComponentLink1URL: https://datasheet.ciiva.com/853/hc-49usx-853344.pdf?src-supplier=Digi-Key; ComponentLink1Description: https://datasheet.ciiva.com/853/hc-49usx-853344.pdf?src-supplier=Digi-Key; Supplier Part Number 1: X1076-ND